# EasyEDA Pro project haptic_knob.eprj, board PCB9_3
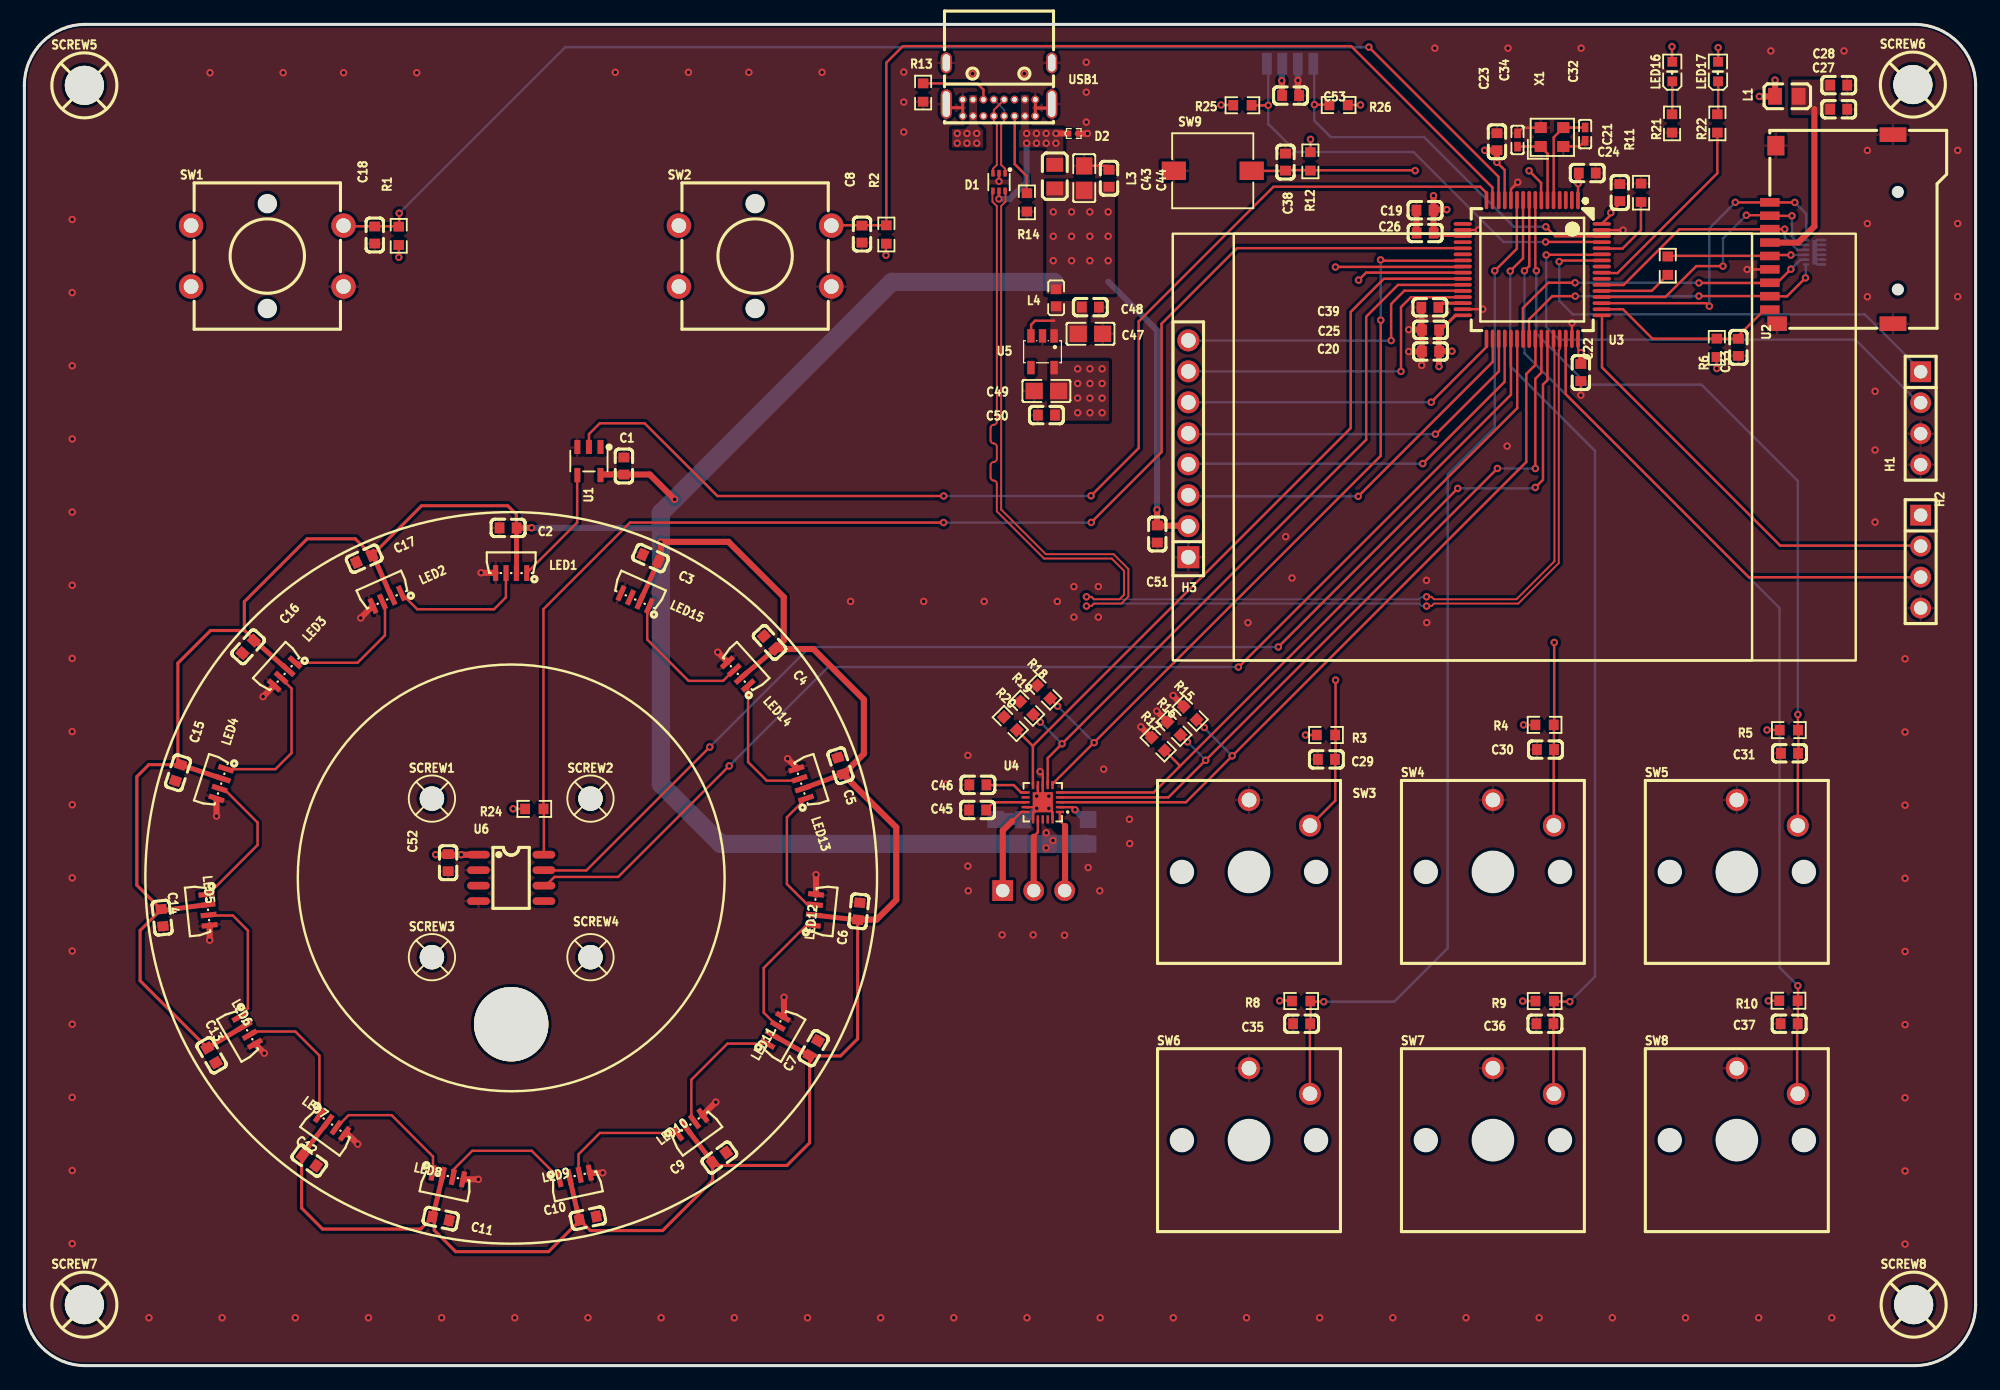
[diagram p1: board, top side]
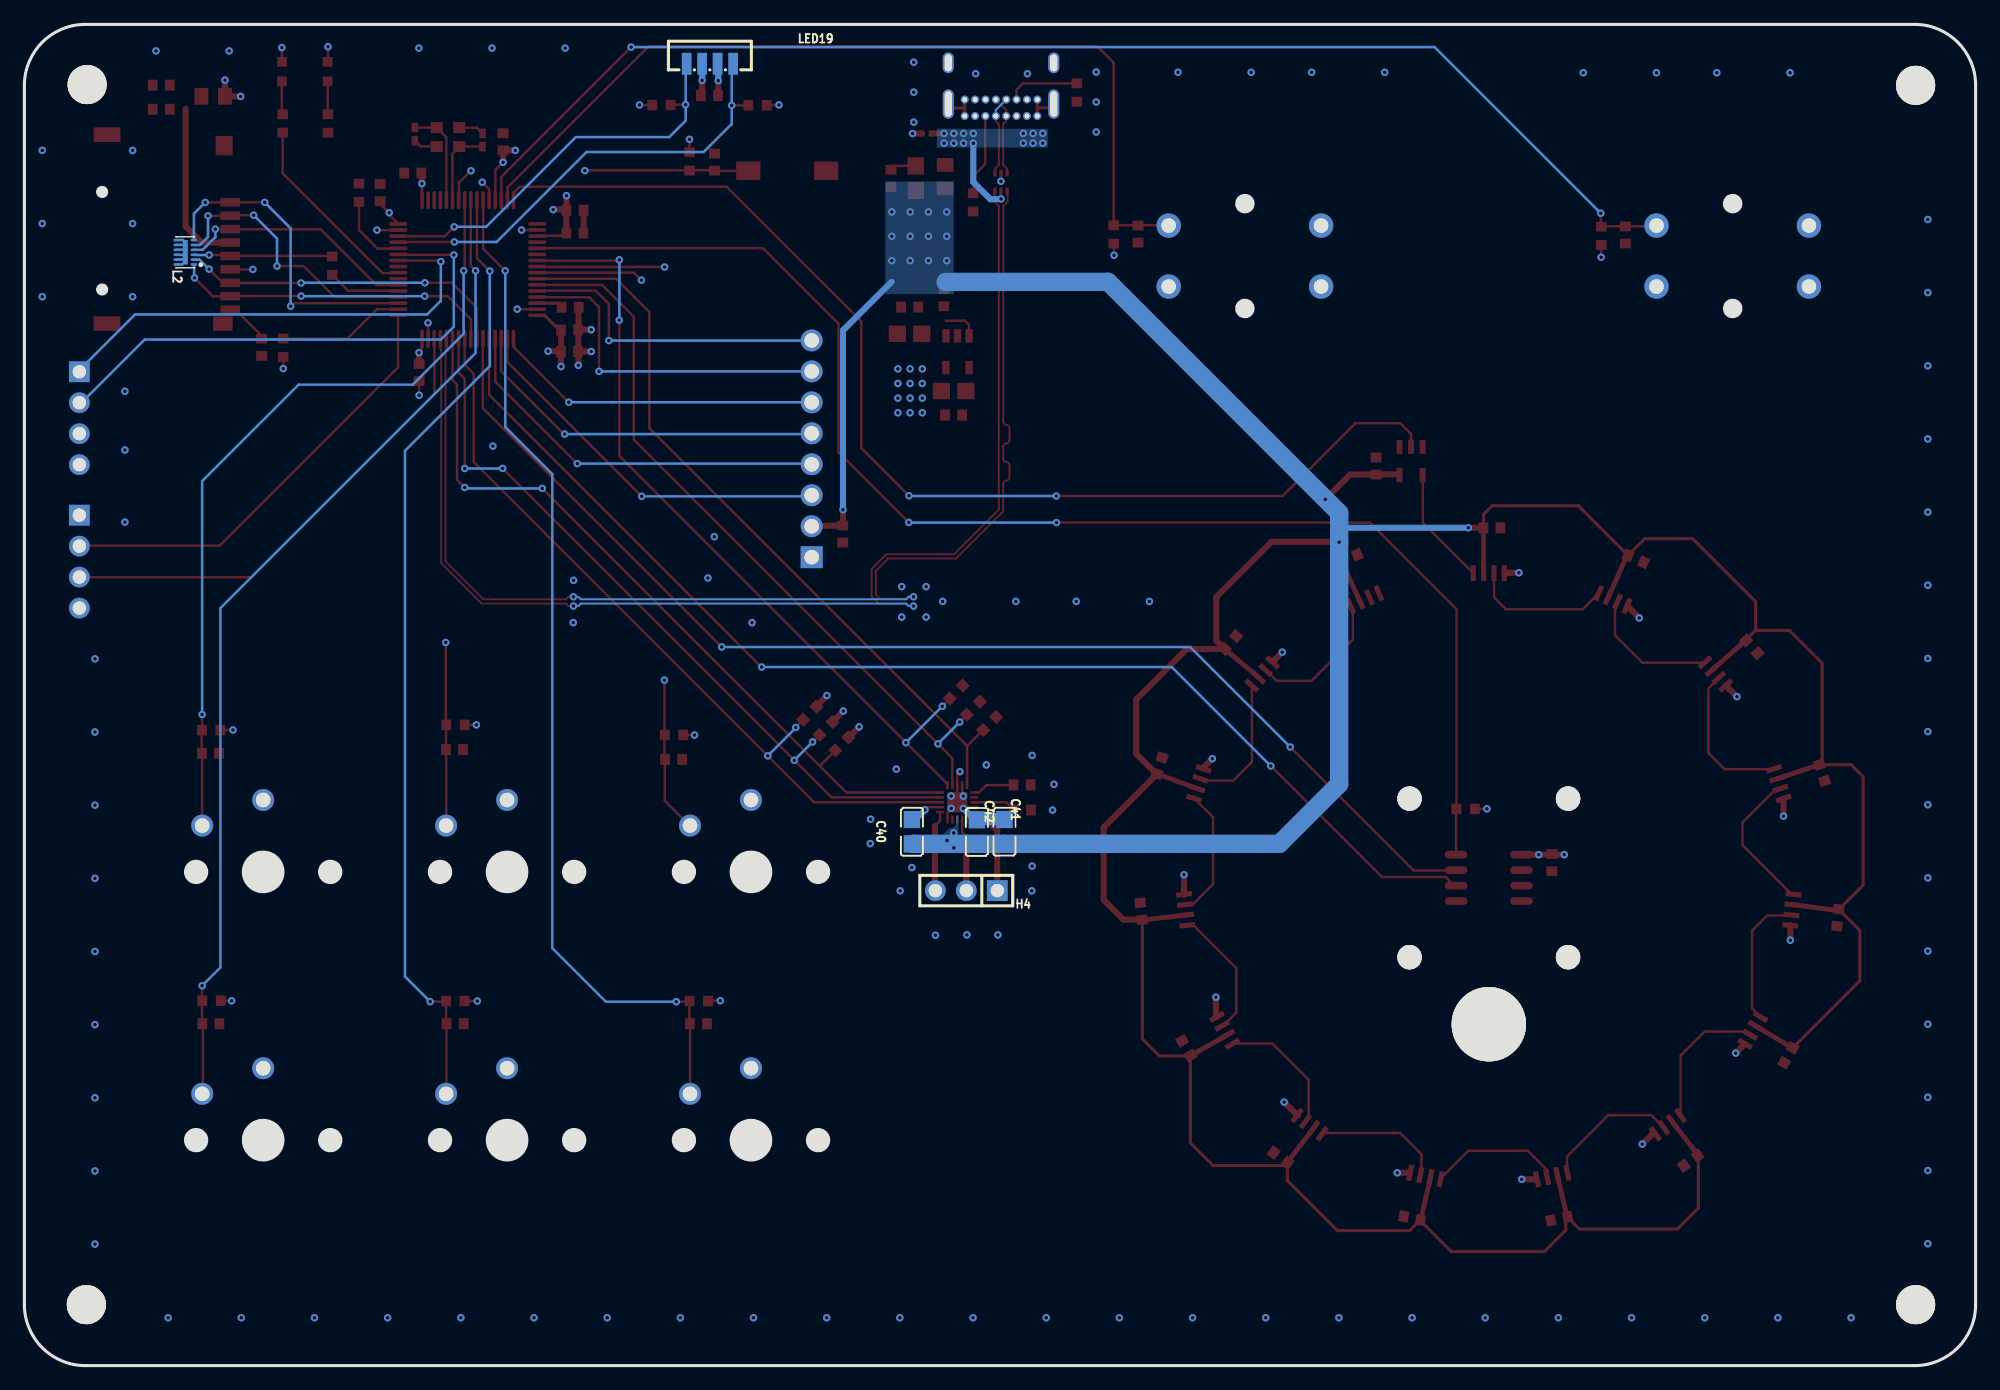
[diagram p2: board, bottom side, seen from below]

Outline 160 x 110 mm; copper layers: Top Layer, Inner1, Inner2, Bottom Layer. Coordinates in mm from the lower left corner of the outline.
Outline path: 0,105 0,5 arc(1.46,1.46) 5,0 155,0 arc(158.54,1.46) 160,5 160,105 arc(158.54,108.54) 155,110 5,110 arc(1.46,108.54) 0,105
Stack: Top Layer 0.035mm Outer layer thickness 1oz / Dielectric1 0.2104mm 7628 RC49% 8.6mil / Inner1 0.0152mm Inner layer thickness / Dielectric2 1.065mm 1.1mm H/HOZ Copper / Inner2 0.0152mm Inner layer thickness / Dielectric3 0.2104mm 7628 RC49% 8.6mil / Bottom Layer 0.035mm Outer layer thickness 1oz

## Design rules (mm)
net USB_DM: DP1
net USB_DP: DP1
net DP: DP2
net DN: DP2
template: Custom Config
spacing copperThickness1oz (default): track to track 0.152, other pairs 0.152 to 0.3
spacing copperThickness2oz: track to track 0.152, other pairs 0.152 to 0.3
spacing Batt: track to track 0.5, other pairs 0.152 to 0.5
track width copperThickness1oz (default): min 0.154, default 0.2, max 2.54
track width copperThickness2oz: min 0.154, default 0.2, max 2.54
differential pair differentialPair (default): width min 0.156, default 0.156, max 2.54; gap min 0.2, default 0.2
via viaSize (default): diameter min 0.5, default 0.61, max 10; hole min 0.3, default 0.305, max 6.3

## Placement (name value [footprint] x y rotation side)
C1  100nF  [C0603]  49.16 73.78 270 top
C2  100nF  [C0603]  39.66 68.7 0 top
C3  100nF  [C0603]  51.35 66.23 336 top
C4  100nF  [C0603]  61.1 59.31 312 top
C5  100nF  [C0603]  66.92 49.2 288 top
C6  100nF  [C0603]  68.43 37.26 264 top
C7  100nF  [C0603]  64.72 26.04 240 top
C8  100nF  [C0603]  68.68 92.8 90 top
C9  100nF  [C0603]  56.99 17.06 216 top
C10  100nF  [C0603]  46.21 12.09 192 top
C11  100nF  [C0603]  34.14 12.05 168 top
C12  100nF  [C0603]  23.36 16.81 144 top
C13  100nF  [C0603]  15.35 25.45 120 top
C14  100nF  [C0603]  11.29 36.74 96 top
C15  100nF  [C0603]  12.6 48.62 72 top
C16  100nF  [C0603]  18.35 58.95 48 top
C17  100nF  [C0603]  27.86 66.17 24 top
C18  100nF  [C0603]  28.73 92.73 90 top
C19  4.7uF  [C0603]  114.85 94.76 0 top
C20  1uF  [C0603]  115.3 83.17 0 top
C21  100nF  [C0603]  130.83 96.21 270 top
C22  100nF  [C0603]  127.63 81.44 90 top
C23  100nF  [C0603]  120.75 100.38 270 top
C24  100nF  [C0603]  128.16 97.81 180 top
C25  100nF  [C0603]  115.3 84.95 0 top
C26  100nF  [C0603]  114.86 92.89 0 top
C27  2.2uF  [C0603]  148.77 103.04 180 top
C28  100nF  [C0603]  148.77 105.02 180 top
C29  100nF  [C0603]  106.76 49.72 0 top
C30  100nF  [C0603]  124.73 50.52 0 top
C31  100nF  [C0603]  144.74 50.22 0 top
C32  10pF  [C0402]  127.98 101 270 top
C33  100nF  [C0603]  140.54 83.51 90 top
C34  10pF  [C0402]  122.43 100.52 90 top
C35  100nF  [C0603]  104.73 28.04 0 top
C36  100nF  [C0603]  124.68 28.04 0 top
C37  100nF  [C0603]  144.71 28.04 0 top
C38  100nF  [C0603]  103.41 98.71 270 top
C39  2.2uF  [C0603]  115.25 86.8 0 top
C40  100nF  [C0805]  87.22 43.79 270 bottom
C41  22uF  [C0805]  79.63 43.79 270 bottom
C42  100nF  [C0805]  81.9 43.77 270 bottom
C43  22uF  [C0805]  86.91 97.39 270 top
C44  100nF  [C0603]  88.94 97.38 270 top
C45  100nF  [C0603]  78.16 45.57 0 top
C46  100nF  [C0603]  78.19 47.63 0 top
C47  22uF  [C0805]  87.42 84.62 180 top
C48  100nF  [C0603]  87.41 86.81 180 top
C49  22uF  [C0805]  83.81 79.93 0 top
C50  100nF  [C0603]  83.81 77.96 0 top
C51  100nF  [C0603]  92.9 68.2 90 top
C52  100nF  [C0603]  34.75 41.25 90 top
C53  100nF  [C0603]  103.83 104.16 180 top
D1  USBLC6-2P6  [SOT-563_L1.6-W1.2-P0.50-LS1.6-BL]  79.92 97.07 180 top
D2  ESD5V0L  [DFN1006-2L_L1.0-W0.6-P0.65-RD]  86.05 101.05 0 top
H1  -  [HDR-TH_4P-P2.54-V-M]  155.5 77.7 270 top
H2  -  [HDR-TH_4P-P2.54-V-M]  155.5 65.94 270 top
H3  -  [HDR-TH_8P-P2.54-V-F-1]  95.44 75.19 90 top
H4  -  [HDR-TH_3P-P2.54-V-M]  82.76 38.96 0 bottom
L1  BLM21PG331SN1D  [L0805]  144.52 104.1 180 top
L2  8.5pF  [DFN-12_L2.5-W1.4-P0.40-BL-EP]  146.81 91.31 90 bottom
L3  BLM21PG331SN1D  [L0805]  84.49 97.51 270 top
L4  MPZ1608S601ATA00  [L0603]  84.6 87.58 270 top
LED1  WS2812B-4020  [LED-SMD_WS2812B-4020]  39.92 65 0 top
LED2  WS2812B-4020  [LED-SMD_WS2812B-4020]  29.75 62.83 24 top
LED3  WS2812B-4020  [LED-SMD_WS2812B-4020]  21.34 56.73 48 top
LED4  WS2812B-4020  [LED-SMD_WS2812B-4020]  16.14 47.73 72 top
LED5  WS2812B-4020  [LED-SMD_WS2812B-4020]  15.06 37.38 96 top
LED6  WS2812B-4020  [LED-SMD_WS2812B-4020]  18.27 27.5 120 top
LED7  WS2812B-4020  [LED-SMD_WS2812B-4020]  25.23 19.77 144 top
LED8  WS2812B-4020  [LED-SMD_WS2812B-4020]  34.72 15.55 168 top
LED9  WS2812B-4020  [LED-SMD_WS2812B-4020]  45.12 15.55 192 top
LED10  WS2812B-4020  [LED-SMD_WS2812B-4020]  54.61 19.77 216 top
LED11  WS2812B-4020  [LED-SMD_WS2812B-4020]  61.57 27.5 240 top
LED12  WS2812B-4020  [LED-SMD_WS2812B-4020]  64.78 37.38 264 top
LED13  WS2812B-4020  [LED-SMD_WS2812B-4020]  63.7 47.73 288 top
LED14  WS2812B-4020  [LED-SMD_WS2812B-4020]  58.5 56.73 312 top
LED15  WS2812B-4020  [LED-SMD_WS2812B-4020]  50.09 62.83 336 top
LED16  KT-0603W  [LED0603-R-RD_WHITE]  135.13 106.13 90 top
LED17  KT-0603W  [LED0603-R-RD_WHITE]  138.88 106.13 90 top
LED19  VEML7700-TR  [LED-SMD_4P-L6.8-W2.4_VEML7700-TR]  103.79 106.77 180 bottom
NOREF  -  [Pad_e7156]  39.92 28 0 top
R1  10kΩ  [R0603]  30.7 92.66 270 top
R2  10kΩ  [R0603]  70.68 92.77 270 top
R3  10kΩ  [R0603]  106.73 51.72 180 top
R4  10kΩ  [R0603]  124.66 52.55 180 top
R5  10kΩ  [R0603]  144.69 52.12 180 top
R6  47kΩ  [R0603]  138.78 83.47 270 top
R7  0Ω  [R0603]  134.76 90.21 90 top
R8  10kΩ  [R0603]  104.7 29.9 180 top
R9  10kΩ  [R0603]  124.66 29.9 180 top
R10  10kΩ  [R0603]  144.65 29.93 180 top
R11  10kΩ  [R0603]  132.57 96.19 270 top
R12  100kΩ  [R0603]  105.45 98.76 90 top
R13  5.1kΩ  [R0603]  73.7 104.41 90 top
R14  5.1kΩ  [R0603]  82.21 95.4 90 top
R15  10kΩ  [R0603]  95.6 53.51 315 top
R16  10kΩ  [R0603]  94.26 52.25 315 top
R17  10kΩ  [R0603]  92.97 50.99 315 top
R18  10kΩ  [R0603]  83.59 55.25 315 top
R19  10kΩ  [R0603]  82.18 53.92 315 top
R20  10kΩ  [R0603]  80.84 52.66 315 top
R21  330Ω  [R0603]  135.11 101.88 90 top
R22  330Ω  [R0603]  138.82 101.88 90 top
R24  10kΩ  [R0603]  41.81 45.66 180 top
R25  4.7kΩ  [R0603]  99.88 103.37 180 top
R26  4.7kΩ  [R0603]  107.77 103.39 0 top
SCREW1  -  [Screw-Hole-M2]  33.42 46.5 0 top
SCREW2  -  [Screw-Hole-M2]  46.42 46.5 0 top
SCREW3  -  [Screw-Hole-M2]  33.42 33.5 0 top
SCREW4  -  [Screw-Hole-M2]  46.42 33.5 0 top
SCREW5  -  [Screw-Hole-M3]  4.98 104.94 0 top
SCREW6  -  [Screw-Hole-M3]  154.92 105 0 top
SCREW7  -  [Screw-Hole-M3]  4.98 4.94 0 top
SCREW8  -  [Screw-Hole-M3]  154.98 4.94 0 top
SW1  TS1103S-12x12x7.3YDIP  [SW-TH_4P-L12.0-W12.0-P5.00-LS12.5-TL]  19.92 91 0 top
SW2  TS1103S-12x12x7.3YDIP  [SW-TH_4P-L12.0-W12.0-P5.00-LS12.5-TL]  59.92 91 0 top
SW3  CPG135001D01  [KEY-TH_CPG135001D0X]  102.92 45.34 0 top
SW4  CPG135001D01  [KEY-TH_CPG135001D0X]  122.92 45.34 0 top
SW5  CPG135001D01  [KEY-TH_CPG135001D0X]  142.92 45.34 0 top
SW6  CPG135001D01  [KEY-TH_CPG135001D0X]  102.92 23.34 0 top
SW7  CPG135001D01  [KEY-TH_CPG135001D0X]  122.92 23.34 0 top
SW8  CPG135001D01  [KEY-TH_CPG135001D0X]  142.92 23.34 0 top
SW9  SPEH130103  [SW-SMD_L6.0-W6.0-LS6.6]  97.44 97.99 180 top
U1  74LV1T34GV-TP  [SOT-23-5_L3.0-W1.7-P0.95-LS2.8-BL]  46.29 74.19 180 top
U2  A-MicroTF-1.85A  [TF-SMD_A-MICROTF-1.85A]  148.18 93.21 90 top
U3  STM32F411RCT6  [LQFP-64_L10.0-W10.0-P0.50-LS12.0-BL]  123.64 89.9 180 top
U4  TMC6300-LA-T  [QFN-20_L3.0-W3.0-P0.40-BL-EP1.7]  83.51 46.2 90 top
U5  TLV75533PDBVR  [SOT-23-5_L3.0-W1.7-P0.95-LS2.8-BR]  83.49 83.15 90 top
U6  MT6701CT-STD  [SOP-8_L4.9-W3.9-P1.27-LS6.0-BL]  39.92 40 270 top
USB1  USB4085-GF-A  [USC-C-SMD_USB4085-GF-A]  79.92 104.66 180 top
X1  16MHz  [CRYSTAL-SMD_4P-L2.5-W2.0-BL-A]  125.27 100.76 0 top

## Footprints (pads in the part's own frame, mm; a bottom-side part is the same pattern mirrored in y, then rotated)
C0402
  rect 0.79x0.54 smd: 1(-0.545,0) 2(0.545,0)
C0603
  rect 0.8x0.9 smd: 1(-0.7,0) 2(0.7,0)
C0805
  rect 1.41x1.35 smd: 1(-1,0) 2(1,0)
CRYSTAL-SMD_4P-L2.5-W2.0-BL-A
  rect 1x0.9 smd: 1(-0.925,-0.775) 2(0.925,-0.775) 3(0.925,0.775) 4(-0.925,0.775)
DFN1006-2L_L1.0-W0.6-P0.65-RD
  rect 0.25x0.5 smd: 1(-0.325,0) 2(0.325,0)
DFN-12_L2.5-W1.4-P0.40-BL-EP
  rect 0.2x0.5 smd: 1(-1,-0.7) 2(-0.6,-0.7) 3(-0.2,-0.7) 4(0.2,-0.7) 5(0.6,-0.7) 6(1,-0.7) 7(1,0.7) 8(0.6,0.7) 9(0.2,0.7) 10(-0.2,0.7) 11(-0.6,0.7) 12(-1,0.7)
  rect 2x0.4 smd: 13(0,0)
HDR-TH_3P-P2.54-V-M
  rect 1.7x1.7 hole 1.1: 1(-2.54,0)
  round 1.7 hole 1.1: 2(0,0) 3(2.54,0)
HDR-TH_4P-P2.54-V-M
  rect 1.7x1.7 hole 1.1: 1(-3.81,0)
  round 1.7 hole 1.1: 2(-1.27,0) 3(1.27,0) 4(3.81,0)
HDR-TH_8P-P2.54-V-F-1
  rect 1.8x1.8 hole 1.2: 1(-8.89,0)
  round 1.8 hole 1.2: 2(-6.35,0) 3(-3.81,0) 4(-1.27,0) 5(1.27,0) 6(3.81,0) 7(6.35,0) 8(8.89,0)
KEY-TH_CPG135001D0X
  round 1.8 hole 1.2: 1(-2.5,1.05) 2(2.5,-1.05)
L0603
  rect 0.8x0.864 smd: 1(-0.7,0) 2(0.7,0)
L0805
  rect 1.133x1.377 smd: 1(-0.966,0) 2(0.966,0)
LED0603-R-RD_WHITE
  rect 0.8x0.8 smd: 1(0.8,0) 2(-0.8,0)
LED-SMD_4P-L6.8-W2.4_VEML7700-TR
  rect 0.8x1.8 smd: 1(1.905,0) 2(0.635,0) 3(-0.635,0) 4(-1.905,0)
LED-SMD_WS2812B-4020
  rect 0.42x1.3 smd: 1(1.275,0) 2(0.425,0) 3(-0.425,0) 4(-1.275,0)
LQFP-64_L10.0-W10.0-P0.50-LS12.0-BL
  oval 0.3x1.5 smd: 1(-3.75,-5.688) 2(-3.25,-5.688) 3(-2.75,-5.688) 4(-2.25,-5.688) 5(-1.75,-5.688) 6(-1.25,-5.688) 7(-0.75,-5.688) 8(-0.25,-5.688) 9(0.25,-5.688) 10(0.75,-5.688) 11(1.25,-5.688) 12(1.75,-5.688) 13(2.25,-5.688) 14(2.75,-5.688) 15(3.25,-5.688) 16(3.75,-5.688) 33(3.75,5.688) 34(3.25,5.688) 35(2.75,5.688) 36(2.25,5.688) 37(1.75,5.688) 38(1.25,5.688) 39(0.75,5.688) 40(0.25,5.688) 41(-0.25,5.688) 42(-0.75,5.688) 43(-1.25,5.688) 44(-1.75,5.688) 45(-2.25,5.688) 46(-2.75,5.688) 47(-3.25,5.688) 48(-3.75,5.688)
  oval 1.5x0.3 smd: 17(5.7,-3.738) 18(5.7,-3.238) 19(5.7,-2.738) 20(5.7,-2.238) 21(5.7,-1.738) 22(5.7,-1.238) 23(5.7,-0.739) 24(5.7,-0.238) 25(5.7,0.262) 26(5.7,0.762) 27(5.7,1.262) 28(5.7,1.762) 29(5.7,2.261) 30(5.7,2.762) 31(5.7,3.261) 32(5.7,3.762) 49(-5.7,3.762) 50(-5.7,3.261) 51(-5.7,2.762) 52(-5.7,2.261) 53(-5.7,1.762) 54(-5.7,1.262) 55(-5.7,0.762) 56(-5.7,0.262) 57(-5.7,-0.238) 58(-5.7,-0.739) 59(-5.7,-1.238) 60(-5.7,-1.738) 61(-5.7,-2.238) 62(-5.7,-2.738) 63(-5.7,-3.238) 64(-5.7,-3.738)
Pad_e7156
  rrect 6.096x6.096 hole 6.096: 1(0,0)
QFN-20_L3.0-W3.0-P0.40-BL-EP1.7
  rect 0.2x0.665 smd: 1(-0.8,-1.407) 2(-0.4,-1.407) 3(0,-1.407) 4(0.4,-1.407) 5(0.8,-1.407) 11(0.8,1.407) 12(0.4,1.407) 13(0,1.407) 14(-0.4,1.407) 15(-0.8,1.407)
  rect 0.665x0.2 smd: 6(1.407,-0.8) 7(1.407,-0.4) 8(1.407,0) 9(1.407,0.4) 10(1.407,0.8) 16(-1.407,0.8) 17(-1.407,0.4) 18(-1.407,0) 19(-1.407,-0.4) 20(-1.407,-0.8)
  rect 1.65x1.65 smd: 21(0,0)
R0603
  rect 0.806x0.864 smd: 1(-0.753,0) 2(0.753,0)
Screw-Hole-M2
  round 2 hole 2: 1(0,0)
Screw-Hole-M3
  round 3.2 hole 3.2: 1(-0.064,0.064)
SOP-8_L4.9-W3.9-P1.27-LS6.0-BL
  oval 0.63x1.865 smd: 1(-1.905,-2.683) 2(-0.635,-2.683) 3(0.635,-2.683) 4(1.905,-2.683) 5(1.905,2.683) 6(0.635,2.683) 7(-0.635,2.683) 8(-1.905,2.683)
SOT-23-5_L3.0-W1.7-P0.95-LS2.8-BL
  rect 0.49x1.157 smd: 1(-0.95,-1.153) 2(0,-1.153) 3(0.95,-1.153)
  rect 0.49x1.175 smd: 4(0.95,1.153) 5(-0.95,1.153)
SOT-23-5_L3.0-W1.7-P0.95-LS2.8-BR
  rect 1.1x0.6 smd: 1(1.3,-0.95) 2(1.3,0) 3(1.3,0.95) 4(-1.3,0.95) 5(-1.3,-0.95)
SOT-563_L1.6-W1.2-P0.50-LS1.6-BL
  rect 0.28x0.545 smd: 1(-0.5,-0.723) 2(0,-0.723) 3(0.5,-0.723) 4(0.5,0.723) 5(0,0.723) 6(-0.5,0.723)
SW-SMD_L6.0-W6.0-LS6.6
  rect 1.985x1.512 smd: 1(-3.192,0) 2(3.192,0)
SW-TH_4P-L12.0-W12.0-P5.00-LS12.5-TL
  round 2 hole 1.2: 1(-6.25,2.5) 2(6.25,2.5) 3(-6.25,-2.5) 4(6.25,-2.5)
TF-SMD_A-MICROTF-1.85A
  rect 0.7x1.6 smd: 1(2.2,5.05) 2(1.1,5.05) 3(0,5.05) 4(-1.1,5.05) 5(-2.2,5.05) 6(-3.3,5.05) 7(-4.4,5.05) 8(-5.5,5.05) 9(-6.6,5.05)
  rect 1.2x1.6 smd: 10(-7.75,4.45)
  rect 1.2x2.2 smd: 10(-7.75,-5.05) 10(7.75,-5.05)
  rect 1.6x1.4 smd: 10(6.85,4.55)
USC-C-SMD_USB4085-GF-A
  round 0.65 hole 0.4: A1(-2.975,2.18) A4(-2.125,2.18) A5(-1.275,2.18) A6(-0.425,2.18) A7(0.425,2.18) A8(1.275,2.18) A9(2.125,2.18) A12(2.975,2.18) B1(2.98,0.83) B4(2.13,0.83) B5(1.28,0.83) B6(0.43,0.83) B7(-0.42,0.83) B8(-1.27,0.83) B9(-2.12,0.83) B12(-2.975,0.83)
  oval 0.9x2.4 hole 0.6x2.1: S1(-4.325,1.2) S1(4.325,1.2)
  oval 0.9x1.7 hole 0.6x1.4: S1(-4.325,-2.18) S1(4.325,-2.18)

## Nets
As in the schematic.

Pads without a net: LED15 3; NOREF 1; SCREW1 1; SCREW2 1; SCREW3 1; SCREW4 1; SCREW5 1; SCREW6 1; SCREW7 1; SCREW8 1; SW1 1 3; SW2 1 3; U1 1; U3 2 3 4 17 20 22 55 57; U4 19; U5 4; U6 3 5; USB1 A8 B8

## Via types
v1: diameter 0.61, hole 0.305, Top Layer to Bottom Layer, 285 vias

## Routing (per net, layer and track width the routed paths; a pad name or vN(x,y) marks a point on that pad's centre or on a via; arc(x,y) is an arc through that point)
3.3V: length 47.7
  Top Layer w0.2: 41.02,45.67 v1(40.07,45.67) ; 129.35,93.65 130.09,94.39 130.09,94.54 ; 143.95,52.13 v1(142.9,52.13) ; v1(102.94,29.92) 102.95,29.94 103.94,29.94 ; 138.89,106.94 v1(138.89,108.1) ; 115.57,92.85 115.76,92.67 117.91,92.67 ; 99.15,103.39 v1(98.12,103.39) ; 123.91,29.9 v1(122.86,29.9) ; 127.41,83.87 127.41,83.31 127.64,83.08 ; 130.81,95.5 130.81,95.28 v1(130.09,94.55) ; 30.7,91.91 v1(30.7,90.9) ; v1(70.65,91.06) 70.65,91.95 70.61,91.99 ; v1(143,29.92) 143.01,29.92 143.91,29.92 ; v1(120.75,98.69) 121.38,98.05 121.38,95.59 ; 108.54,103.39 v1(109.56,103.39) ; 135.1,106.94 v1(135.1,108.17) ; 127.41,96.91 127.4,96.9 127.4,95.65 127.37,95.62 ; v1(105.05,51.72) 105.05,51.72 105.98,51.72 ; 105.46,99.52 v1(105.46,100.57) ; 123.92,52.55 v1(122.94,52.55) ; 138.77,82.71 v1(138.77,81.78)
  Top Layer w0.254: 116.17,84.96 117.35,86.14
  Top Layer w0.5: 127.44,97.78 127.41,97.75 v1(127.41,96.94) ; 115.55,92.92 115.55,94.74 115.53,94.76 ; 115.58,94.82 116.63,94.82 v1(116.64,94.81) ; 103.11,105.4 103.1,105.39 103.1,104.18 ; 120.71,99.67 v1(119.74,99.67) ; 120.74,99.63 120.74,98.75 120.71,98.72 ; 37.23,41.9 34.75,41.9 v1(33.73,41.91) ; v1(143.55,105.43) 143.56,105.43 143.56,104.12 ; 116,83.21 v1(116,81.94) ; 127.64,83.08 127.64,82.15 ; 116.06,83.2 v1(117.06,83.2) ; 143.55,104.09 v1(142.27,104.09) ; 116.02,83.16 116.03,83.17 ; 115.55,94.79 v1(115.55,95.95) ; 115.99,84.96 115.99,83.22
  Bottom Layer w0.5: v1(103.11,105.39) 103.11,106.71 103.12,106.72
  vias: v1(35.82,41.9) v1(86.37,81.75) v1(86.37,80.55) v1(86.37,79.35) v1(86.37,78.15) v1(87.37,81.75) v1(87.37,80.55) v1(87.37,79.35) v1(87.37,78.15) v1(88.37,81.75) v1(88.37,80.55) v1(88.37,79.35) v1(88.37,78.15) v1(127.64,83.08)
5V_IN: length 7.7
  Top Layer w0.2: 79.91,96.36 v1(79.91,95.68)
  Top Layer w0.5: 84.6,101.05 85.58,101.05 85.59,101.04
  Bottom Layer w0.5: 79.93,95.67 80.79,95.67 82.19,97.06 82.19,100.27
  vias: v1(76.49,101.06) v1(76.49,100.26) v1(77.29,101.06) v1(77.29,100.26) v1(78.09,101.06) v1(78.09,100.26) v1(82.19,101.06) v1(82.19,100.26) v1(82.99,101.06) v1(82.99,100.26) v1(83.79,101.06) v1(83.79,100.26) v1(84.59,101.06) v1(84.59,100.26)
+5V: length 398
  Top Layer w0.254: 12.77,49.29 10.21,49.29 9.22,48.3 9.22,39.4 11.23,37.4 ; 18.03,60.29 18.06,60.29 18.8,59.55 ; 18.03,60.29 18.03,62.66 23.19,67.81 27.13,67.81 28.52,66.42 ; 18.03,60.29 15.26,60.29 12.59,57.61 12.59,49.5 12.83,49.25 ; 45.52,11.88 42.98,9.35 35.36,9.35 33.61,11.1 33.61,12.25 ; 64.4,25.4 66.92,25.4 68.33,26.8 68.33,36.55 ; 11.2,37.4 9.49,35.69 9.49,31.57 14.94,26.11 15,26.17 ; 45.49,11.99 46.41,11.08 52.33,11.08 56.44,15.18 56.44,16.63 ; 33.46,12.16 32.5,11.2 24.45,11.2 22.73,12.92 22.73,17.22 ; 64.39,25.41 64.4,25.4 ; 40.35,68.67 40.33,69.82 39.64,70.52 32.57,70.52 28.57,66.52 ; 56.67,16.41 62.53,16.41 64.39,18.27 64.39,25.37
  Top Layer w0.4: 44.68,15.48 45.47,12.09 ; 18.06,27.87 15.06,26.07 ; 63.82,47.32 67.14,48.55 ; 21.64,57.02 18.85,59.48 ; 50.45,62.61 51.99,65.96 ; 34.3,15.64 33.5,12.19 ; 64.36,25.42 61.35,27.12 ; 64.4,25.4 64.41,25.4 ; 15.01,37.81 11.24,37.31 ; 58.76,56.43 61.57,58.77 ; 54.25,19.52 56.45,16.64 ; 28.57,66.52 28.56,66.54 ; 12.83,49.28 16.28,48.12 ; 40.35,64.97 40.35,68.67 ; 24.89,20.02 22.79,17.31 ; 64.74,36.96 68.33,36.55 ; 30.12,62.98 28.58,66.49
  Top Layer w0.5: 61.64,58.77 64.7,58.77 68.84,54.64 68.84,50.18 67.15,48.49 ; 67.15,48.49 67.13,48.48 ; 67.15,48.49 71.5,44.14 71.5,38.19 ; v1(53.32,71.05) 51.28,73.08 49.19,73.08 ; 92.89,68.92 92.88,68.94 v1(92.88,70.19) ; v1(52.19,67.54) 52.19,66.17 51.98,65.97 ; 71.49,38.19 69.89,36.58 68.29,36.58 ; 92.91,68.89 95.33,68.89 95.4,68.81 ; 47.25,73.09 49.15,73.09 ; 61.6,58.81 62.26,59.47 62.26,63.03 57.73,67.56 52.23,67.56 ; 41.59,68.71 40.37,68.71
  Bottom Layer w0.5: 88.89,88.89 92.88,84.9 v1(92.88,70.19) ; 52.17,68.71 v1(41.6,68.71)
  Bottom Layer w1.5: 84.46,88.88 71.13,88.88 52.19,69.93 52.19,68.72 ; 52.19,68.71 v1(52.19,67.54) 52.19,47.69 57.09,42.79 C41.2 87.07,42.79 87.08,42.78
  vias: v1(83.79,43.69) v1(83.78,42.46) v1(84.37,94.62) v1(84.37,92.62) v1(84.37,90.62) v1(84.34,43.06) v1(85.87,94.62) v1(85.87,92.62) v1(85.87,90.62) v1(87.37,94.62) v1(87.37,92.62) v1(87.37,90.62) v1(88.87,94.62) v1(88.87,92.62) v1(88.87,90.62)
GND: length 73.2
  Top Layer w0.2: v1(122.46,97.05) 121.9,96.49 121.9,95.59 ; 126.2,100 127.5,100 127.97,100.46 ; 83.12,46.14 83.1,46.16 83.1,47.61 ; 82.71,44.81 82.71,45.38 83.12,45.79 ; 79.92,97.79 v1(79.92,97.13) ; 124.35,101.52 122.89,101.52 122.43,101.07 ; 82.09,45.8 83.11,45.8 ; 83.51,46.22 83.51,48.49 v1(83.29,48.72) ; 127.63,80.71 v1(127.63,79.58) ; 84.3,44.82 84.3,45.41 83.52,46.18 ; 117.94,93.13 119.23,93.13 v1(119.23,93.13) ; 126.9,84.37 v1(126.9,85.53) ; 129.34,93.12 v1(131.09,93.12) ; 143.16,89.89 143.15,89.9 v1(141.27,89.9) ; 117.93,86.64 v1(119.59,86.64) ; 88.98,98.16 88.73,98.4 86.91,98.4
  Top Layer w0.254: 76.94,103.85 76.94,102.49 76.93,102.48 ; 75.67,103.16 76.93,103.16 76.93,103.16
  Top Layer w0.255: 84.31,103.11 84.28,103.13 82.91,103.13 ; 82.9,103.83 82.9,102.5
  Top Layer w0.5: 28.57,62.32 27.58,61.33 v1(27.58,61.32) ; 63.32,48.96 63.32,49.05 v1(62.59,49.78) ; 26.29,19.01 26.49,19.01 v1(27.33,18.17) ; 20.49,55.77 20.47,55.77 v1(19.57,54.87) ; 86.38,101.04 87.17,101.04 v1(87.17,101.05) ; v1(47.42,15.81) 47.42,15.82 46.36,15.82 ; 95.08,54.06 94.19,54.94 v1(94.19,54.96) ; 114.56,86.81 114.56,84.97 ; 114.14,92.92 114.14,94.83 ; v1(91.55,52.39) 91.55,52.38 92.41,51.52 ; v1(114.58,82.04) 114.57,82.04 114.57,83.16 ; v1(92.85,53.68) 92.85,53.67 93.74,52.78 ; v1(64.91,40.27) 64.91,38.64 64.9,38.63 ; 35.99,15.28 v1(37.22,15.28) ; 114.58,84.94 114.58,83.19 ; 62.19,28.61 62.29,28.71 v1(62.29,30.21) ; v1(104.43,105.4) 104.43,104.22 104.47,104.19 ; v1(37.45,65.02) 38.62,65.02 38.63,65.01 ; v1(15.19,34.89) 15.19,34.89 15.19,36.12 ; 57.66,57.7 v1(56.85,58.51) ; 55.59,20.5 v1(56.7,21.61) ; 15.75,46.47 v1(15.75,45.07) ; 114.6,83.17 v1(113.52,83.17) ; 114.55,84.96 v1(113.52,84.96) ; 18.91,26.39 v1(19.67,25.62)
  Bottom Layer w0.2: 146.79,92.11 147,92.32 147.54,92.32 ; 147.53,91.09 146.78,91.09 ; 146.9,91.5 146.92,91.52 147.52,91.52 ; 147.57,90.31 147.07,90.31 146.81,90.56 ; 147.53,91.92 147.52,91.92 146.78,91.92 ; 147.5,90.72 146.79,90.72
  Bottom Layer w0.5: 104.42,106.74 104.42,105.41 v1(104.43,105.4) ; 82.09,44.8 83,45.72
  Bottom Layer w1: 79.58,44.83 81.88,44.83
  vias: v1(3.92,94) v1(3.92,88) v1(3.92,82) v1(3.92,76) v1(3.92,70) v1(3.92,64) v1(3.92,58) v1(3.92,52) v1(3.92,46) v1(3.92,40) v1(3.92,34) v1(3.92,28) v1(3.92,22) v1(3.92,16) v1(3.92,10) v1(10.21,3.92) v1(15.22,106.04) v1(16.21,3.92) v1(21.22,106.04) v1(22.21,3.92) v1(26.17,106.04) v1(28.21,3.92) v1(32.17,106.04) v1(34.21,3.92) v1(40.21,3.92) v1(46.21,3.92) v1(48.45,106.07) v1(52.21,3.92) v1(54.45,106.07) v1(58.21,3.92) v1(59.41,106.07) v1(64.21,3.92) v1(65.41,106.07) v1(67.75,62.68) v1(70.21,3.92) v1(72.11,106.09) v1(72.11,103.63) v1(72.11,101.17) v1(73.75,62.68) v1(75.57,47.67) v1(75.69,45.56) v1(76.21,3.92) v1(77.37,50.04) v1(77.37,40.97) v1(77.4,38.94) v1(77.75,105.95) v1(78.7,62.68) v1(80.17,35.33) v1(81.13,49.26) v1(82,105.95) v1(82.21,3.92) v1(82.72,35.33) v1(83.01,46.71) v1(83.01,45.71) v1(84.01,46.71) v1(84.01,45.71) v1(84.7,62.68) v1(85.29,35.3) v1(86.06,63.89) v1(86.06,61.39) v1(87.07,106.9) v1(87.07,104.44) v1(87.07,101.98) v1(87.23,40.85) v1(88.06,63.89) v1(88.06,61.39) v1(88.18,38.94) v1(88.21,3.92) v1(88.5,48.92) v1(90.61,44.81) v1(90.64,42.82) v1(94.21,3.92) v1(100.21,3.92) v1(100.33,60.93) v1(103.43,67.98) v1(103.95,64.59) v1(106.21,3.92) v1(112.21,3.92) v1(114.97,64.4) v1(114.99,60.94) v1(115.65,108.05) v1(118.21,3.92) v1(121.65,108.05) v1(121.58,75.42) v1(124.21,3.92) v1(127.65,108.05) v1(130.21,3.92) v1(136.21,3.92) v1(142.21,3.92) v1(143.21,107.83) v1(148.21,3.92) v1(149.21,107.83) v1(151.13,99.66) v1(151.13,93.66) v1(151.13,87.66) v1(151.76,79.91) v1(151.76,75.09) v1(151.76,69.18) v1(154.21,57.97) v1(154.21,51.97) v1(154.21,45.97) v1(154.21,39.97) v1(154.21,33.97) v1(154.21,27.97) v1(154.21,21.97) v1(154.21,15.97) v1(154.21,9.97) v1(158.53,99.67) v1(158.53,93.67) v1(158.53,87.67)
/RESET: length 25.5
  Top Layer w0.2: 105.44,98.03 114.01,98.03 v1(114.04,98) ; v1(123.38,98) 124.37,97.01 124.37,95.55 ; 105.43,98.03 105.44,98.02 ; 103.36,98.05 103.37,98.06 ; 100.61,97.98 103.3,97.98 ; 105.42,98.04 103.37,98.04
  Inner2 w0.2: 123.33,98 114.05,98 v1(114.04,98)
A: length 100.6
  Top Layer w0.2: v1(99.54,57.29) 99.57,57.29 121.9,79.62 121.9,84.21 ; v1(57.79,49.18) 57.79,49.18 48.69,40.08 43.46,40.08 42.82,39.44 42.66,39.44 42.6,39.37
  Bottom Layer w0.2: v1(57.79,49.18) 65.91,57.29 v1(99.54,57.29)
B: length 101.2
  Top Layer w0.2: 122.41,84.18 122.41,78.53 v1(102.82,58.94) ; v1(56.2,50.73) 46.08,40.61 42.61,40.61
  Bottom Layer w0.2: 102.84,58.93 64.4,58.93 v1(56.2,50.73)
BLK: length 26
  Top Layer w0.2: v1(112.07,84.07) 112.07,87.07 113.16,88.16 117.95,88.16
  Bottom Layer w0.2: v1(112.07,84.07) 95.43,84.07 95.39,84.11
BTN1: length 107.8
  Top Layer w0.2: 120.88,95.56 120.88,97.5 v1(110.25,108.14) ; 30.7,93.44 26.25,93.44 26.2,93.49 ; 30.75,93.48 30.68,93.41 ; v1(30.74,94.51) 30.74,93.5
  Bottom Layer w0.2: v1(30.74,94.51) 44.36,108.14 v1(110.25,108.14)
BTN2: length 74
  Top Layer w0.2: 120.38,95.59 120.38,96.63 108.8,108.21 72.03,108.21 70.68,106.86 70.68,93.65 70.56,93.53 ; 70.64,93.51 70.66,93.53 66.22,93.53 66.18,93.49 ; 70.68,93.53 70.68,93.53
CLK: length 11.5
  Top Layer w0.2: 143.11,91.03 143.16,91.08 v1(144.85,91.08) ; 143.16,91.02 134.81,91.02 134.75,90.95
  Bottom Layer w0.2: 146.11,91.08 v1(144.85,91.08)
CS: length 28.2
  Top Layer w0.2: 117.99,87.62 113.69,87.62 112.88,86.81 v1(112.88,81.54)
  Bottom Layer w0.2: 95.44,81.53 95.45,81.54 v1(112.88,81.54)
DC: length 27
  Top Layer w0.2: 119.9,84.22 119.9,83.55 v1(115.36,79.01)
  Bottom Layer w0.2: 95.44,79.04 95.47,79.01 v1(115.36,79.01)
DN: length 6.6
  Top Layer w0.156: D1.3 79.42,98.16 79.74,98.48 79.74,101.82 79.49,102.06 USB1.A7 79.49,102.97 80.34,103.82
DP: length 6.6
  Top Layer w0.156: D1.1 80.42,98.16 80.1,98.48 80.1,101.82 80.34,102.06 USB1.A6
  Bottom Layer w0.156: 80.35,102.48 80.35,102.97 USB1.B6
I2C_SCL: length 37.4
  Top Layer w0.2: 129.32,92.16 124.74,92.16 v1(124.74,92.15) ; 100.66,103.36 v1(102,103.36)
  Bottom Layer w0.2: v1(124.74,92.15) 121.28,92.15 113.9,99.53 104.3,99.53 102.02,101.82 ; 101.91,106.54 102,106.46 102,101.79
I2C_SDA: length 33.4
  Top Layer w0.2: 107,103.42 v1(105.78,103.42) ; v1(124.76,93.4) 125.54,92.62 129.39,92.62
  Bottom Layer w0.2: 105.69,106.74 105.77,106.65 105.77,102.11 107.12,100.76 114.78,100.76 122.13,93.4 v1(124.76,93.4)
KEY1: length 84.3
  Top Layer w0.2: 105.39,22.32 105.41,22.34 105.41,28.01 105.47,28.07 105.47,29.87 ; v1(120.57,89.79) 122.38,91.6 122.38,95.61 ; v1(106.55,29.85) 105.5,29.85
  Bottom Layer w0.2: v1(120.57,89.79) 120.57,76.98 116.71,73.12 116.71,34.24 112.32,29.85 v1(106.55,29.85)
KEY2: length 57.2
  Top Layer w0.2: 107.49,49.64 107.49,46.34 105.4,44.24 ; 107.49,49.64 107.52,49.8 107.52,51.69 ; 107.49,49.64 107.47,49.61 ; v1(107.51,90.1) 107.52,90.11 117.98,90.11 ; v1(107.51,56.22) 107.51,51.69
  Inner2 w0.2: v1(107.51,56.22) 107.51,56.23 v1(107.51,90.1)
KEY3: length 78.9
  Top Layer w0.2: 125.41,22.33 125.39,22.35 125.39,28.02 125.42,28.06 125.42,29.85 ; 125.42,29.85 125.42,29.92 ; 125.42,29.85 v1(126.73,29.85) ; 122.89,95.57 122.89,90.82 v1(121.84,89.77) ; 125.39,29.89 125.35,29.92
  Bottom Layer w0.2: v1(126.73,29.85) 128.79,31.92 128.79,75.02 121.84,81.98 v1(121.84,89.77)
KEY4: length 60.2
  Top Layer w0.2: 125.37,52.56 125.39,52.58 ; 125.44,52.64 125.44,59.33 ; v1(109.4,89.03) 110.02,89.64 117.93,89.64 ; 125.43,52.55 125.43,50.54 125.41,50.52 125.41,44.32
  Inner2 w0.2: 109.33,89.07 109.33,75.43 v1(125.45,59.31)
KEY5: length 82.9
  Top Layer w0.2: 123.4,95.6 123.4,90.18 v1(123,89.79) ; 145.44,29.93 145.44,29.88 ; 145.44,29.93 145.44,31.14 v1(145.42,31.16) ; 145.44,29.93 145.42,28.12 145.36,28.06 145.36,22.34 145.42,22.28
  Bottom Layer w0.2: v1(123,89.79) 123,83.04 143.93,62.12 143.93,32.65 v1(145.42,31.16)
KEY6: length 65.7
  Top Layer w0.2: 145.41,44.29 145.43,44.3 145.43,50.2 145.46,50.24 145.46,52.15 ; 123.9,95.59 123.9,89.89 123.98,89.8 ; v1(145.43,53.4) 145.43,52.17 145.4,52.15
  Bottom Layer w0.2: v1(145.43,53.4) 145.43,72.54 137.52,80.45 128.16,80.45 123.98,84.63 v1(123.98,89.79)
LED1: length 16.2
  Top Layer w0.2: 129.32,89.61 130.63,89.61 138.82,97.79 138.82,101.11
LED_DATA_3.3V: length 94.9
  Top Layer w0.2: 119.89,95.58 119.89,96.18 119.38,96.69 102.43,96.69 91.37,85.63 91.37,75.25 v1(87.46,71.34) ; v1(75.38,71.32) 56.82,71.32 50.86,77.29 47.18,77.29 46.3,76.4 46.3,75.37 46.28,75.35
  Bottom Layer w0.2: v1(75.38,71.32) 87.46,71.32 87.47,71.33
LED_DATA_5V: length 9.8
  Top Layer w0.2: 45.33,73.1 45.33,69.14 41.18,64.99
RES: length 30.3
  Top Layer w0.2: 120.9,84.22 120.91,84.21 120.91,81.55 115.76,76.4 v1(115.7,76.4)
  Bottom Layer w0.2: 95.43,76.48 95.51,76.4 v1(115.7,76.4)
SD_VDD: length 13.8
  Top Layer w0.5: 146.78,103.06 146.78,93.43 145.45,92.1 143.13,92.1
SDMMC1_CD_GPIO: length 15.9
  Top Layer w0.2: 140.57,84.24 140.57,84.48 142.71,86.62 143.12,86.62 ; 140.59,84.21 138.79,84.21 138.77,84.22 133.5,84.22 131.09,86.64 129.34,86.64
SDMMC1_CLK: length 6
  Top Layer w0.2: 129.3,88.15 133.44,88.15 134.75,89.46
SDMMC1_CMD: length 19.8
  Top Layer w0.2: 143.15,93.21 v1(144.34,93.21) ; 143.13,93.3 143.19,93.23 ; 143.13,93.19 135.7,93.19 131.14,88.63 129.34,88.63
  Bottom Layer w0.2: v1(144.34,93.21) 144.34,92.55 145.38,91.51 146.09,91.51
SDMMC1_D0: length 27.5
  Top Layer w0.2: 143.11,88.83 143.1,88.81 ; 127.15,88.81 124.96,88.81 122.88,86.73 122.88,84.1 ; 143.08,88.79 v1(137.31,88.79) ; 143.12,88.79 143.72,88.79 v1(144.85,89.93)
  Bottom Layer w0.2: 137.33,88.81 137.32,88.81 v1(127.16,88.81) ; 146.07,90.71 145.63,90.71 v1(144.85,89.93)
SDMMC1_D1: length 26.8
  Top Layer w0.2: v1(137.31,87.72) 143.12,87.72 ; 143.12,87.72 144.53,87.69 v1(146.05,89.21) ; 143.12,87.72 143.13,87.72 ; 127.16,87.71 125.29,87.71 123.38,85.81 123.38,84.19
  Bottom Layer w0.2: v1(146.05,89.21) 146.08,89.24 146.08,90.3 ; v1(127.17,87.71) 137.31,87.71 137.32,87.72
SDMMC1_D2: length 26.6
  Top Layer w0.2: 143.13,95.41 143.15,95.4 v1(145.17,95.4) ; v1(138.17,86.89) 137.92,87.13 129.35,87.13 ; v1(140.29,95.4) 143.11,95.4
  Bottom Layer w0.2: v1(138.17,86.89) 138.17,93.28 v1(140.29,95.4) ; v1(145.17,95.4) 146.1,94.47 146.1,92.32
SDMMC1_D3: length 22.8
  Top Layer w0.2: v1(141.2,94.35) 143.1,94.35 ; 143.12,94.3 v1(144.94,94.3) ; v1(139.28,90.18) 137.09,90.18 134.56,87.64 129.33,87.64
  Bottom Layer w0.2: v1(144.94,94.3) 144.94,92.58 145.61,91.91 146.09,91.91 ; v1(139.28,90.18) 139.28,92.43 v1(141.2,94.35)
SPI2_MOSI: length 32.2
  Top Layer w0.2: v1(114.66,73.98) 121.38,80.7 121.38,84.22
  Bottom Layer w0.2: 95.46,73.94 95.5,73.98 v1(114.66,73.98)
SPI2_SCL: length 31.4
  Top Layer w0.2: 120.41,84.19 120.41,82.33 v1(109.38,71.29)
  Bottom Layer w0.2: 95.45,71.39 95.55,71.29 v1(109.38,71.29)
SWCLK: length 36.5
  Top Layer w0.2: 155.53,67.25 143.98,67.25 129.36,81.87 129.36,86.05 129.33,86.08
SWDIO: length 39.9
  Top Layer w0.2: 155.5,64.66 141.41,64.66 126.38,79.68 126.38,84.2
U: length 7.4
  Top Layer w0.2: 81.74,45.4 82.07,45.4 ; 81.74,45.4 80.99,44.66 80.99,44.63
  Top Layer w0.5: 80.23,38.92 80.23,43.89 ; 80.99,44.64 80.98,44.64 80.23,43.89
UH: length 64.4
  Top Layer w0.2: 123.9,84.23 123.9,82.08 123.15,81.33 123.15,74.11 95.25,46.21 84.92,46.21 ; v1(96.75,52.34) 96.74,52.34 96.11,52.97
  Bottom Layer w0.2: v1(99.04,50.01) 96.75,52.31 v1(96.75,52.34)
UL: length 66.1
  Top Layer w0.2: 117.96,90.62 111.28,90.62 v1(111.21,90.69) ; v1(111.22,85.74) 111.22,85.74 111.22,74.62 84.31,47.71 84.31,47.6 ; 84.11,54.7 v1(84.73,54.08)
  Bottom Layer w0.2: v1(111.22,85.74) 111.21,85.76 111.21,90.69 v1(111.21,90.69) ; v1(84.73,54.08) v1(87.72,51.09)
USART1_RX: length 43.8
  Top Layer w0.2: v1(124.79,91.09) 124.8,91.1 129.37,91.1
  Bottom Layer w0.2: 155.51,79.06 155.22,79.06 150.14,84.15 125.84,84.15 124.79,85.21 124.79,91.11
USART1_TX: length 38.7
  Top Layer w0.2: v1(125.85,90.55) 125.94,90.63 129.36,90.63
  Bottom Layer w0.2: 155.42,81.71 150.92,86.21 126.97,86.21 125.85,87.33 v1(125.85,90.55)
USB_DM: length 103.5
  Top Layer w0.156: v1(114.98,63.06) 115.38,63.06 115.58,62.85 122.35,62.85 125.46,65.97 125.46,83.29 125.39,83.37 U3.44 ; v1(87.09,63.06) 87.49,63.06 87.69,62.85 89.8,62.85 90.17,63.22 90.17,65.18 89.16,66.19 83.61,66.19 79.74,70.06 79.74,72.33 arc(79.67,72.51) 79.48,72.59 arc(79.3,72.66) 79.23,72.84 79.23,73.85 arc(79.3,74.04) 79.48,74.11 arc(79.67,74.19) 79.74,74.37 79.74,75.38 arc(79.67,75.56) 79.48,75.64 arc(79.3,75.71) 79.23,75.89 79.23,76.9 arc(79.3,77.08) 79.48,77.16 arc(79.67,77.23) 79.74,77.42 79.74,95.1 79.38,95.46 79.38,96.31 D1.4
  Bottom Layer w0.156: v1(114.98,63.06) 114.58,63.06 114.37,62.85 87.69,62.85 87.49,63.06 v1(87.09,63.06)
USB_DP: length 103.5
  Top Layer w0.156: D1.6 80.45,96.32 80.45,95.46 80.1,95.11 80.1,70.21 83.76,66.55 89.31,66.55 90.53,65.33 90.53,63.08 89.95,62.5 87.69,62.5 87.49,62.29 v1(87.09,62.29) ; U3.45 125.89,83.37 125.82,83.29 125.82,65.82 122.49,62.5 115.58,62.5 115.38,62.29 v1(114.98,62.29)
  Bottom Layer w0.156: v1(114.98,62.29) 114.58,62.29 114.37,62.5 87.69,62.5 87.49,62.29 v1(87.09,62.29)
V: length 5.8
  Top Layer w0.2: 82.68,38.94 82.7,38.93 ; 83.1,44.78 83.1,43.74 82.77,43.4
  Top Layer w0.5: 82.77,43.37 82.76,43.36 82.76,39.12
VH: length 63.9
  Top Layer w0.2: 94.79,51.72 95.36,51.15 v1(95.37,51.15) ; 93.82,46.6 84.87,46.6 ; 120.76,73.55 93.82,46.6 ; 124.39,84.19 124.39,81.43 123.9,80.94 v1(123.9,73.58)
  Bottom Layer w0.2: v1(120.79,73.58) 120.79,73.58 v1(123.9,73.58) ; v1(96.87,49.65) 96.87,49.65 v1(95.37,51.15)
VL: length 61.8
  Top Layer w0.2: 82.7,50.81 82.7,50.8 ; 82.7,50.81 82.7,50.82 ; 82.7,50.81 82.7,47.56 ; 82.7,50.81 81.37,52.13 ; 82.71,50.84 108.76,76.89 108.76,86.42 111.48,89.14 117.96,89.14
W: length 6.7
  Top Layer w0.2: 84.91,45.39 84.91,44.69 85.34,44.26 ; 85.34,39.06 85.22,38.94
  Top Layer w0.5: 85.34,44.26 85.34,39.06
WH: length 63.3
  Top Layer w0.2: 93.5,50.45 93.5,50.45 94.76,49.19 ; 124.88,83.82 124.88,80.82 124.52,80.46 124.52,72.65 123.9,72.02 v1(123.89,72.02) ; 84.92,47.01 92.6,47.01 v1(117.53,71.94)
  Bottom Layer w0.2: v1(123.89,72.02) 123.81,71.94 v1(117.53,71.94)
WL: length 61.6
  Top Layer w0.2: 82.69,53.39 v1(83.3,52.78) ; 117.95,88.63 112.63,88.63 110.03,86.03 110.03,75.94 85.09,51 83.91,49.82 83.91,47.69
  Bottom Layer w0.2: v1(83.3,52.78) 85.09,51
  vias: v1(85.09,50.99)
Z: length 113.8
  Top Layer w0.2: 42.56,45.69 42.56,62.04 49.66,69.14 v1(75.37,69.14) ; v1(87.48,69.15) 93.24,74.92 93.24,85.45 99.44,91.65 117.95,91.65 ; 42.6,41.89 42.6,45.54
  Bottom Layer w0.2: v1(75.37,69.14) 87.47,69.14 v1(87.48,69.15)
$3N85265: length 6
  Top Layer w0.2: 73.71,105.16 78.12,105.16 78.64,104.65 78.64,103.81
$3N85270: length 6.7
  Top Layer w0.2: 82.18,96.19 82.18,97.56 81.21,98.54 81.21,102.44 81.19,102.46
$3N98862: length 2.7
  Top Layer w0.2: v1(86.15,45.58) 85.93,45.8 84.91,45.8
  Bottom Layer w0.5: 87.22,44.8 86.94,44.8 v1(86.15,45.58)
$3N98902: length 3.5
  Top Layer w0.2: 78.86,45.58 79.48,46.21 82.1,46.21
$3N98953: length 3.4
  Top Layer w0.2: 82.07,47 81.72,47 81.11,47.61 78.9,47.61 78.9,47.62
$3N107563: length 11.5
  Top Layer w0.2: 30.92,63.33 30.92,63.33 32.22,62.03 38.51,62.03 39.48,63.01 39.48,65.03
$3N107567: length 11.2
  Top Layer w0.2: 22.17,57.65 27.32,57.65 29.57,59.9 29.57,62.43 29.34,62.66
$3N107572: length 12.4
  Top Layer w0.2: 21.06,56.38 21.91,55.54 21.91,50.24 20.58,48.92 16.53,48.92
$3N107577: length 11.8
  Top Layer w0.2: 15.05,38.63 19.12,42.69 19.12,44.54 16.37,47.29 16.06,47.29
$3N107582: length 11.1
  Top Layer w0.2: 15.07,36.91 17.09,36.91 18.33,35.68 18.33,29.3 17.64,28.61
$3N107587: length 11.6
  Top Layer w0.2: 24.19,20.49 24.19,25.43 22.22,27.4 18.71,27.4 18.47,27.17
$3N107592: length 11
  Top Layer w0.2: 33.51,15.95 33.51,17.14 30.11,20.54 26.59,20.54 25.57,19.53
$3N107597: length 11
  Top Layer w0.2: 43.88,15.34 41.6,17.62 36.72,17.62 35.11,16 35.11,15.43
$3N107605: length 10.6
  Top Layer w0.2: 45.55,15.62 45.44,15.73 45.44,17.34 47.19,19.08 53.53,19.08
$3N143328: length 8.1
  Top Layer w0.2: 126.19,101.53 125.4,100.74 125.4,95.56 ; 126.2,101.56 126.22,101.54 127.98,101.54
$3N143345: length 6.6
  Top Layer w0.2: 124.36,99.98 124.32,99.98 ; 124.32,99.98 124.3,100.01 ; 124.32,99.98 122.44,99.98 122.43,100 ; 124.9,95.56 124.9,99.4 124.34,99.96
$3N163906: length 2.7
  Top Layer w0.2: 135.13,105.32 135.13,102.67 135.12,102.66
$3N173108: length 2.7
  Top Layer w0.2: 138.83,102.67 138.89,102.73 138.89,105.34
$3N173421: length 2.9
  Top Layer w0.2: 84.43,85.69 84.43,85.7 82.88,85.7 82.55,85.37 82.55,84.46
$3N211870: length 2.2
  Top Layer w0.254: 117.97,87.12 117.96,87.13 116.26,87.13 115.93,86.8 115.93,86.79
$3N212247: length 6.2
  Top Layer w0.2: 129.29,91.61 131.04,91.61 132.56,93.13 132.56,95.44
$3N212500: length 10.9
  Top Layer w0.2: 60.89,26.41 57.66,26.41 54.69,23.45 54.69,20.3 54.93,20.06
$3N212674: length 10.6
  Top Layer w0.2: 64.64,36.13 64.14,36.13 60.62,32.61 60.62,28.96 61.63,27.94
$3N212856: length 10.7
  Top Layer w0.2: 64.81,37.81 64.21,37.81 62.53,39.49 62.53,44.97 64.08,46.53
$3N213046: length 11
  Top Layer w0.2: 59.34,55.79 59.34,49.51 60.88,47.97 63.26,47.97 63.38,48.09
$3N213244: length 11.8
  Top Layer w0.2: 58.21,57.08 57.29,56.16 54.46,56.16 51.07,59.55 51.07,62.14 51.24,62.31

## Copper pours and planes (outline as drawn; the poured copper is in the pictures)
3.3V on Top Layer: 84.13,82.4 88.93,82.4 88.93,77.49 84.13,77.49
3.3V on Inner2: 0.17,109.98 160.16,109.98 160.16,0.02 0.17,0.02
5V_IN on Top Layer: 81.54,104.23 85.19,104.23 85.19,97.91 81.54,97.91
5V_IN on Top Layer: 76.07,104.22 78.62,104.22 78.62,99.91 76.07,99.91
5V_IN on Bottom Layer: 76.07,101.43 85.19,101.43 85.19,99.91 76.07,99.91
+5V on Top Layer: 83.41,45.13 84.7,45.13 84.7,42.04 83.41,42.04
+5V on Top Layer: 83.8,97.11 89.41,97.11 89.41,87.88 83.8,87.88
+5V on Bottom Layer: 83.8,97.11 89.41,97.11 89.41,87.88 83.8,87.88
+5V on Bottom Layer: 83.41,45.13 84.7,45.13 84.7,42.04 83.41,42.04
GND on Top Layer: -0.07,109.98 159.91,109.98 159.91,0.02 -0.07,0.02
GND on Bottom Layer: -0.13,110.08 159.85,110.08 159.85,0.12 -0.13,0.12
GND on Inner1: -0.07,109.98 159.91,109.98 159.91,0.02 -0.07,0.02
SD_VDD on Top Layer: 144.88,105.47 148.5,105.47 148.5,102.57 144.88,102.57
$3N173421 on Top Layer: 84.13,87.31 87.17,87.31 87.17,83.9 84.13,83.9
